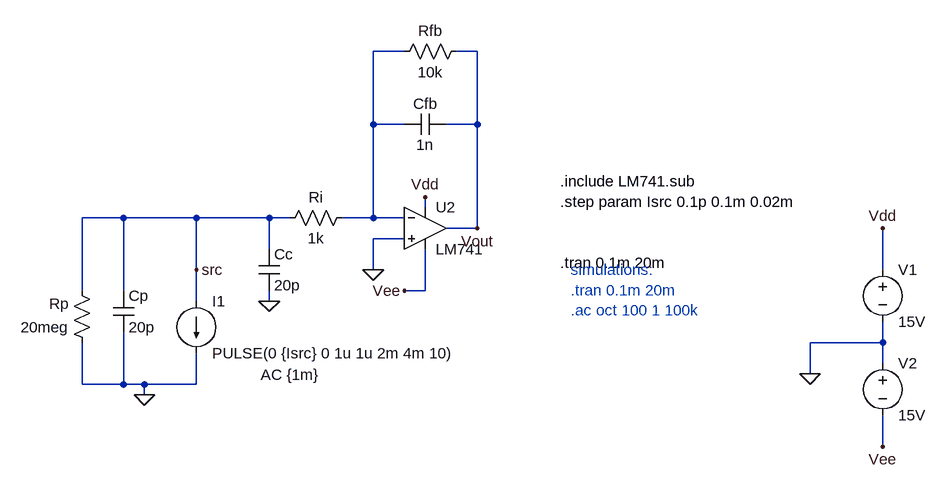
[diagram p0: schematic ChargeAmplifier1.asc]
ChargeAmplifier1.asc, the LTspice schematic file:
Version 4
SHEET 1 1256 680
WIRE 448 -96 400 -96
WIRE 560 -96 528 -96
WIRE 400 16 400 -96
WIRE 448 16 400 16
WIRE 560 16 560 -96
WIRE 560 16 512 16
WIRE 480 144 480 128
WIRE 16 160 -48 160
WIRE 128 160 16 160
WIRE 240 160 128 160
WIRE 272 160 240 160
WIRE 400 160 400 16
WIRE 400 160 352 160
WIRE 448 160 400 160
WIRE 560 176 560 16
WIRE 560 176 512 176
WIRE 448 192 400 192
WIRE 240 208 240 160
WIRE 128 240 128 160
WIRE 400 240 400 192
WIRE 1184 240 1184 176
WIRE -48 272 -48 160
WIRE 16 272 16 160
WIRE 480 272 480 208
WIRE 480 272 448 272
WIRE 128 288 128 240
WIRE 240 288 240 272
WIRE 1184 352 1184 320
WIRE 1184 352 1072 352
WIRE 1184 384 1184 352
WIRE 1072 400 1072 352
WIRE -48 416 -48 352
WIRE 16 416 16 336
WIRE 16 416 -48 416
WIRE 48 416 16 416
WIRE 128 416 128 368
WIRE 128 416 48 416
WIRE 48 432 48 416
WIRE 1184 512 1184 464
FLAG 400 240 0
FLAG 48 432 0
FLAG 560 176 Vout
FLAG 128 240 src
FLAG 480 128 Vdd
FLAG 448 272 Vee
FLAG 1072 400 0
FLAG 1184 176 Vdd
FLAG 1184 512 Vee
FLAG 240 288 0
SYMBOL current 128 288 R0
WINDOW 123 99 113 Left 2
SYMATTR Value2 AC {1m}
SYMATTR InstName I1
SYMATTR Value PULSE(0 {Isrc} 0 1u 1u 2m 4m 10)
SYMBOL cap 512 0 R90
WINDOW 0 0 32 VBottom 2
WINDOW 3 32 32 VTop 2
SYMATTR InstName Cfb
SYMATTR Value 1n
SYMBOL res 544 -112 R90
WINDOW 0 0 56 VBottom 2
WINDOW 3 32 56 VTop 2
SYMATTR InstName Rfb
SYMATTR Value 10k
SYMBOL cap 0 272 R0
SYMATTR InstName Cp
SYMATTR Value 20p
SYMBOL res 368 144 R90
WINDOW 0 0 56 VBottom 2
WINDOW 3 32 56 VTop 2
SYMATTR InstName Ri
SYMATTR Value 1k
SYMBOL Opamps/opamp2 480 112 R0
SYMATTR InstName U2
SYMATTR Value LM741
SYMBOL voltage 1184 224 R0
SYMATTR InstName V1
SYMATTR Value 15V
SYMBOL voltage 1184 368 R0
SYMATTR InstName V2
SYMATTR Value 15V
SYMBOL cap 224 208 R0
SYMATTR InstName Cc
SYMATTR Value 20p
SYMBOL res -32 368 R180
WINDOW 0 36 76 Left 2
WINDOW 3 36 40 Left 2
SYMATTR InstName Rp
SYMATTR Value 20meg
TEXT 688 104 Left 2 !.include LM741.sub\n.step param Isrc 0.1p 0.1m 0.02m\n\n\n.tran 0.1m 20m
TEXT 704 240 Left 2 ;simulations:\n.tran 0.1m 20m\n.ac oct 100 1 100k

The netlist it stands for:
* ChargeAmplifier1.asc
I1 src 0 PULSE(0 {Isrc} 0 1u 1u 2m 4m 10) AC {1m}
Cfb Vout N001 1n
Rfb Vout N001 10k
Cp src 0 20p
Ri N001 src 1k
XU2 0 N001 Vdd Vee Vout LM741  ; pins In+ In- V+ V- OUT
V1 Vdd 0 15V
V2 0 Vee 15V
Cc src 0 20p
Rp 0 src 20meg
.include LM741.sub
.step param Isrc 0.1p 0.1m 0.02m
.tran 0.1m 20m
* simulations:
* .tran 0.1m 20m
* .ac oct 100 1 100k
.backanno
.end